# Altium schematic sheet Part09_Config.SchDoc
size A4
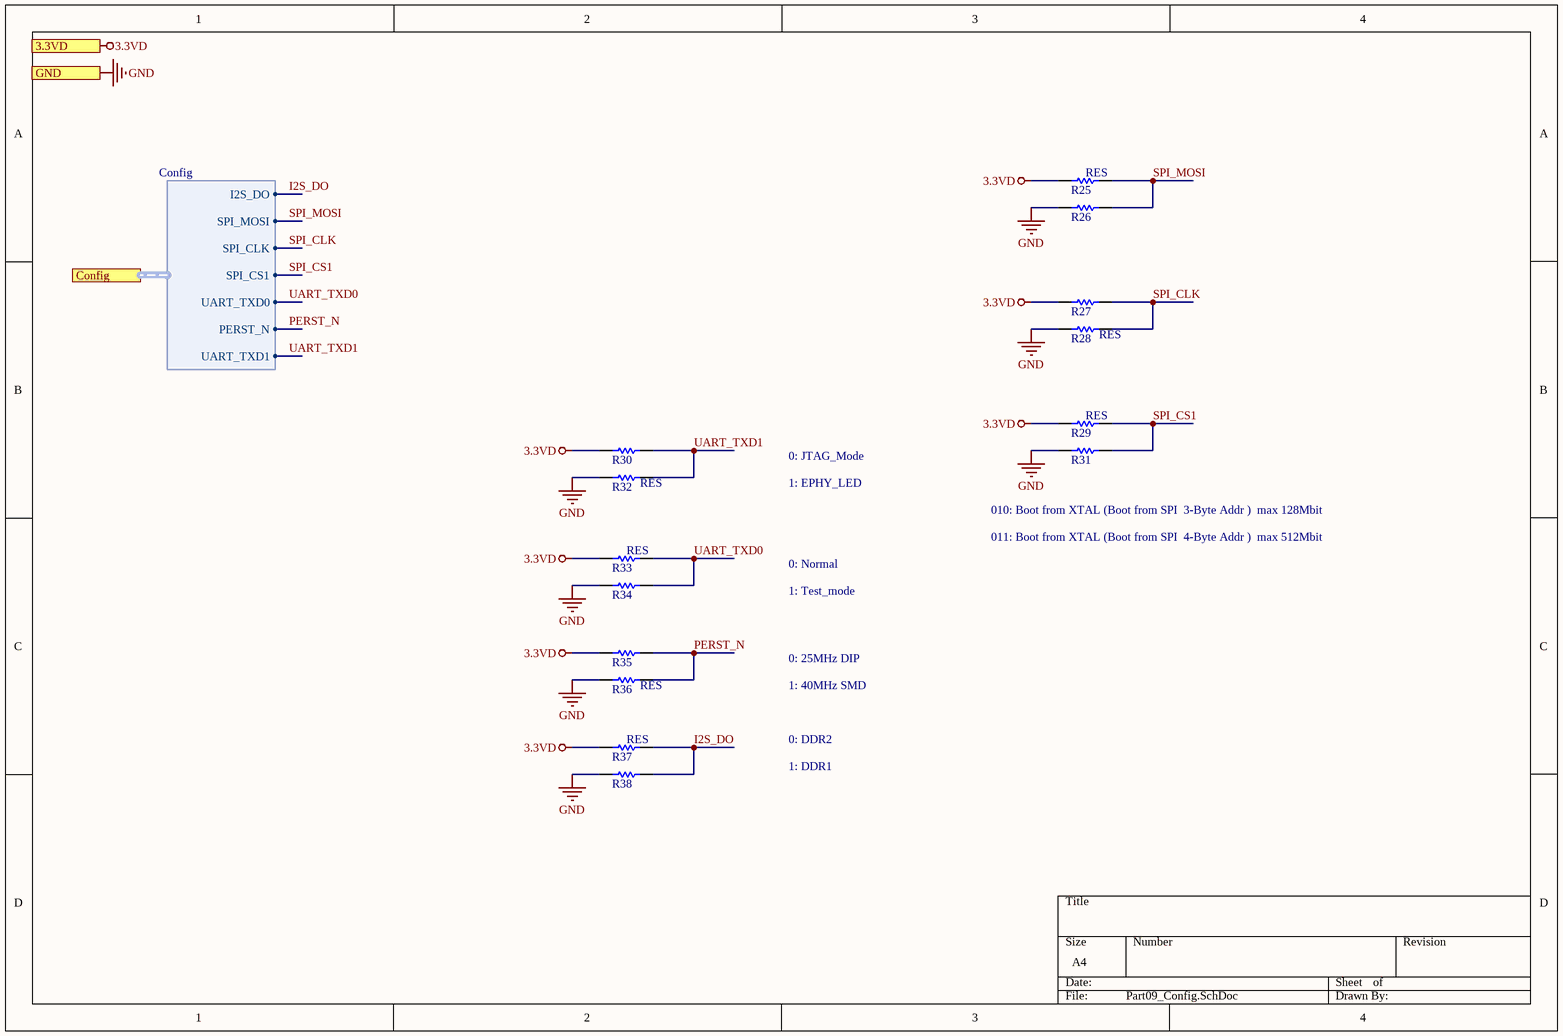
[diagram p0: Part09_Config.SchDoc]

## Parts
R25  RES  [0402R]
R26  RES  [0402R]  (value not drawn)
R27  RES  [0402R]  (value not drawn)
R28  RES  [0402R]
R29  RES  [0402R]
R30  RES  [0402R]  (value not drawn)
R31  RES  [0402R]  (value not drawn)
R32  RES  [0402R]
R33  RES  [0402R]
R34  RES  [0402R]  (value not drawn)
R35  RES  [0402R]  (value not drawn)
R36  RES  [0402R]
R37  RES  [0402R]
R38  RES  [0402R]  (value not drawn)

## Ports
3.3VD, Config (harness Config), GND

## Harnesses
Config: I2S_DO, SPI_MOSI, SPI_CLK, SPI_CS1, UART_TXD0, PERST_N, UART_TXD1

## Nets
3.3VD: R25.1 R27.1 R29.1 R30.1 R33.1 R35.1 R37.1 ; port 3.3VD
GND: R26.1 R28.1 R31.1 R32.1 R34.1 R36.1 R38.1 ; port GND
I2S_DO: R37.2 R38.2 ; port Config.I2S_DO
PERST_N: R35.2 R36.2 ; port Config.PERST_N
SPI_CLK: R27.2 R28.2 ; port Config.SPI_CLK
SPI_CS1: R29.2 R31.2 ; port Config.SPI_CS1
SPI_MOSI: R25.2 R26.2 ; port Config.SPI_MOSI
UART_TXD0: R33.2 R34.2 ; port Config.UART_TXD0
UART_TXD1: R30.2 R32.2 ; port Config.UART_TXD1

## Notes on the sheet
- 0: JTAG_Mode
- 1: EPHY_LED
- 010: Boot from XTAL (Boot from SPI  3-Byte Addr )  max 128Mbit
- 0: Normal
- 011: Boot from XTAL (Boot from SPI  4-Byte Addr )  max 512Mbit
- 1: Test_mode
- 0: 25MHz DIP
- 1: 40MHz SMD
- 0: DDR2
- 1: DDR1